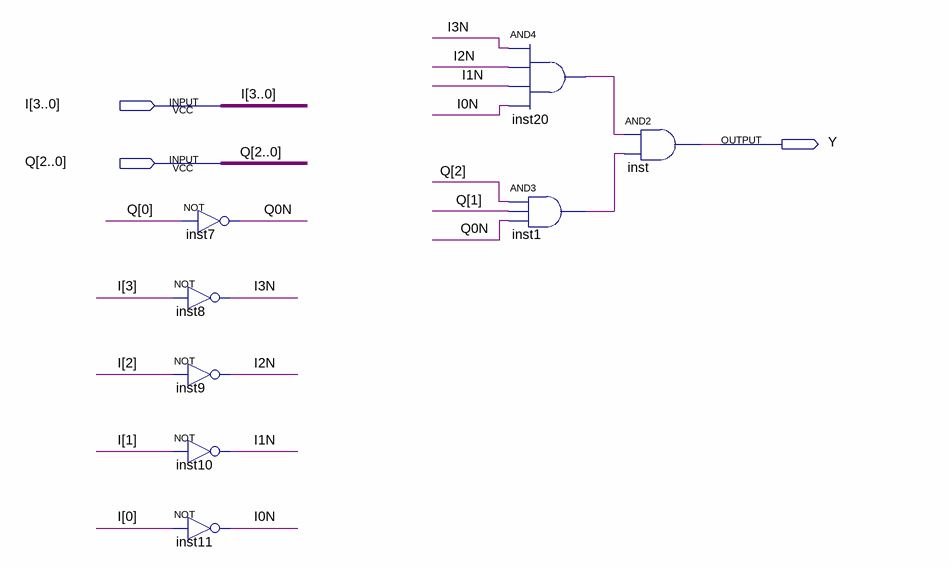
[diagram p0: schematic sheet]
// Quartus schematic OUTPUT_GEN_2.bdf as structural Verilog: 8 symbols, 3 pins
module OUTPUT_GEN_2 (
  input  [3:0] I,
  input  [2:0] Q,
  output Y
);

  wire I0N, I1N, I2N, I3N, inst1_out, inst20_out, Q0N;

  not inst7 (Q0N, Q[0]);
  not inst8 (I3N, I[3]);
  not inst9 (I2N, I[2]);
  not inst10 (I1N, I[1]);
  not inst11 (I0N, I[0]);
  and inst20 (inst20_out, I3N, I2N, I1N, I0N);
  and inst1 (inst1_out, Q[2], Q[1], Q0N);
  and inst (Y, inst20_out, inst1_out);
endmodule
